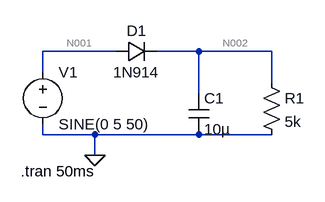
[diagram p0: schematic vipramlyach1.asc]
vipramlyach1.asc, the LTspice schematic file:
Version 4
SHEET 1 880 680
WIRE 144 64 32 64
WIRE 272 64 208 64
WIRE 384 64 272 64
WIRE 32 96 32 64
WIRE 384 112 384 64
WIRE 272 128 272 64
WIRE 32 192 32 176
WIRE 112 192 32 192
WIRE 272 192 112 192
WIRE 384 192 272 192
WIRE 112 224 112 192
FLAG 112 224 0
SYMBOL cap 256 128 R0
SYMATTR InstName C1
SYMATTR Value 10µ
SYMBOL diode 144 80 R270
WINDOW 0 32 32 VTop 2
WINDOW 3 0 32 VBottom 2
SYMATTR InstName D1
SYMATTR Value 1N914
SYMBOL res 368 96 R0
SYMATTR InstName R1
SYMATTR Value 5k
SYMBOL voltage 32 80 R0
WINDOW 123 0 0 Left 2
WINDOW 39 0 0 Left 2
SYMATTR InstName V1
SYMATTR Value SINE(0 5 50)
TEXT -2 248 Left 2 !.tran 50ms

The netlist it stands for:
* vipramlyach1.asc
C1 N002 0 10µ
D1 N001 N002 1N914
R1 N002 0 5k
V1 N001 0 SINE(0 5 50)
.model D D
.lib standard.dio
.tran 50ms
.backanno
.end

* Results of the author's LTspice run, read from the files saved beside the schematic
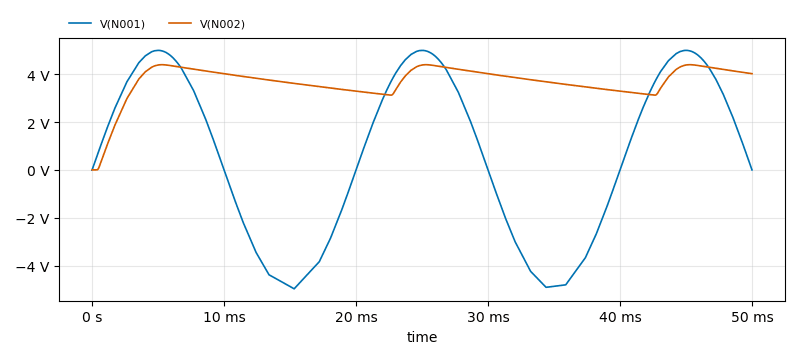
[diagram p1: Transient Analysis of vipramlyach1.asc, plotted from the saved traces]
* Transient Analysis, 1 run:
*   V(N001): min -4.972 V, max 5 V, average 652.9 mV, rms 3.52 V, last 0 V
*   V(N002): min 0 V, max 4.4 V, average 3.684 V, rms 3.755 V, last 4.024 V